# EAGLE design UBEC_V3 (EAGLE 7.6.0)
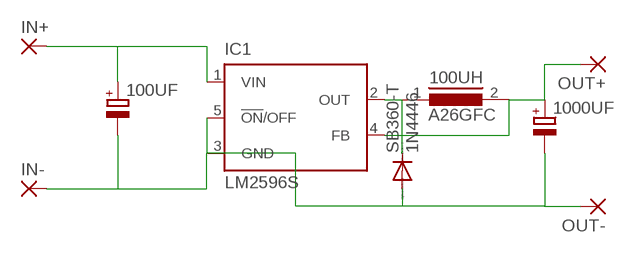
[diagram p0: schematic, sheet 1]

## Parts
100UF  CPOL-EUE3.5-8  [E3,5-8]
100UH  A26GFC  [A26GFC]
1000UF  CPOL-EUE3.5-10  [E3,5-10]
IC1  LM2596S  [TO263-5]
IN+  SMD5  [SMD2,54-5,08]
IN-  SMD5  [SMD2,54-5,08]
OUT+  SMD5  [SMD2,54-5,08]
OUT-  SMD5  [SMD2,54-5,08]
SB360-T  1N4446  [DO35-10]

## Nets
N$1: 100UF.- 1000UF.- IC1.3(GND) IC1.5(!ON!/OFF) IN-.1(P) OUT-.1(P) SB360-T.A
N$2: 100UF.+ IC1.1(VIN) IN+.1(P)
N$3: 100UH.1 IC1.2(OUT) SB360-T.C
N$5: 100UH.2 1000UF.+ IC1.4(FB) OUT+.1(P)

## Library data of the parts
100UF 1000UF = rcl:CPOL-EU: POLARIZED CAPACITOR, European symbol
100UH = inductors:A26GFC: INDUCTOR
IC1 = national-semiconductor:LM2596: SIMPLE SWITCHER® Power Converter 150 kHz 3A Step-Down Voltage Regulator Source: http://www.national.com/ds/LM/LM2596.pdf; MF: NATIONAL SEMICONDUCTOR; MPN: LM2596S-ADJ/NOPB; OC_FARNELL: 9494367; OC_NEWARK: 41K3842
IN+ IN- OUT+ OUT- = wirepad:SMD5: SMD PAD
SB360-T = diode:1N4446: DIODE high speed (Philips)

## Board
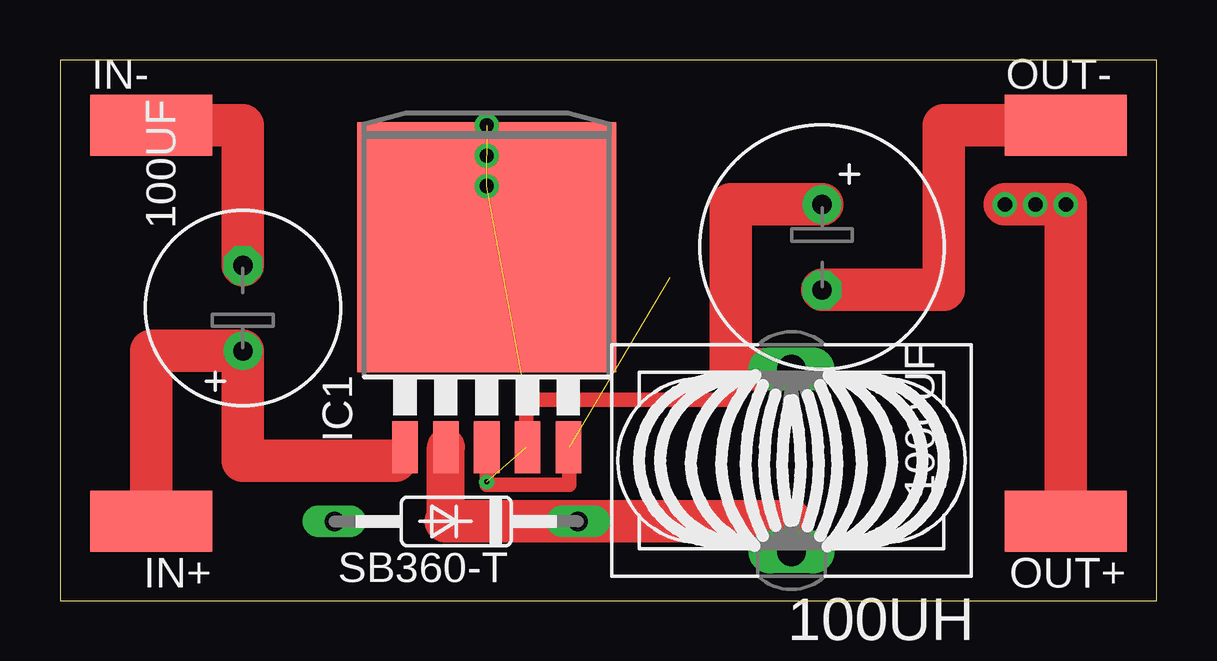
[diagram p1: board, top side]
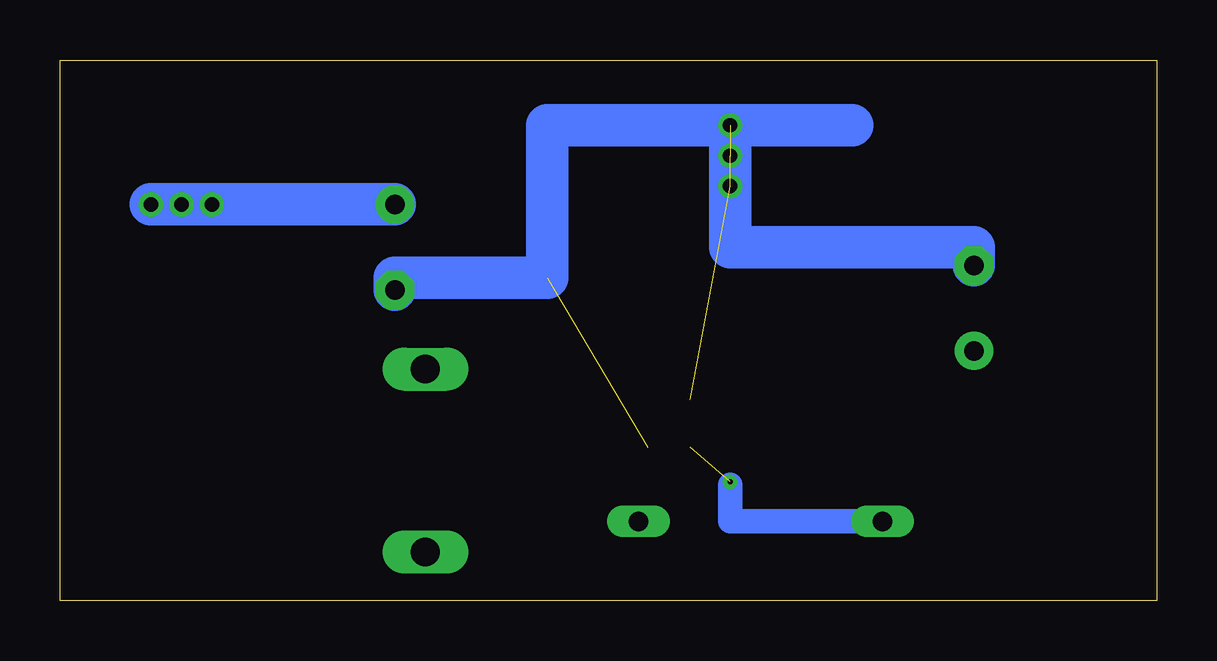
[diagram p2: board, bottom side, seen from below]

Size 45.7 x 22.53 mm. Coordinates in mm from the lower left corner, seen from the top.
Outline: 0,0 45.7,0 45.7,22.53 0,22.53 0,0
Copper layers (1*16): Top 0.035mm / dielectric 1.5mm / Bottom 0.035mm
Design rules "default": minimum track width 10mil, minimum drill 24mil, track to track 8mil, track to pad 8mil, pad to pad 8mil, via to via 8mil, smd to smd 8mil, copper to edge 40mil, drill to drill 8mil, minimum pad ring 10mil, minimum via ring 8mil, stop-mask expansion 4mil, vias tented up to drill 0mil, thermal gap 10mil

### Footprints (pad centres in the part's own frame; a part is rotated, then mirrored left to right if it is on the bottom)
E3,5-8 = drill 0.813 pad 1.6: + -1.778,0 | drill 0.813 pad 1.6 octagon: - 1.778,0
A26GFC = drill 1.194 long: 1 0,3.81; 2 0,-3.81
E3,5-10 = drill 0.813 pad 1.6: + -1.778,0 | drill 0.813 pad 1.6 octagon: - 1.778,0
TO263-5 = smd 1.067 x 2.159: 1 -3.404,-5.791; 2 -1.702,-5.791; 3 0,-5.791; 4 1.702,-5.791; 5 3.404,-5.791 | smd 10.8 x 10.41: 6 0,2.54
SMD2,54-5,08 = smd 2.54 x 5.08: 1 0,0
DO35-10 = drill 0.813 long: A 5.08,0; C -5.08,0

### Placement (x,y rotation side)
100UF  7.62,12.19 90 top
100UH  30.48,5.84 180 top
1000UF  31.75,14.73 270 top
IC1  17.78,12.19 0 top
IN+  3.81,3.3 90 top
IN-  3.81,19.81 270 top
OUT+  41.91,3.3 90 top
OUT-  41.91,19.81 270 top
SB360-T  16.51,3.3 180 top

### Tracks (layer width: path | path; a pad name or v marks a point on that pad's centre or on a via)
N$1  (2 unrouted)
  Top 0.61: IC1.5 21.21,6.4 21.21,4.83 17.78,4.83 IC1.3
  Top 1.778: IN-.1 7.62,19.81 100UF.- | OUT-.1 36.83,19.81 36.83,12.95 1000UF.-
  Bottom 1.016: SB360-T.A 17.78,3.3 17.78,4.83
  Bottom 1.778: 17.78,19.81 17.78,14.73 7.62,14.73 100UF.- | 17.78,19.81 12.7,19.81 | 1000UF.- 31.75,13.46 25.4,13.46 25.4,19.81 17.78,19.81
N$2
  Top 0.406: 13.97,5.84 13.97,6.4 IC1.1
  Top 1.778: 13.97,5.84 7.62,5.84 100UF.+ 3.81,10.41 IN+.1
N$3
  Top 1.575: 16.08,3.3 IC1.2
  Top 1.778: 100UH.1 30.48,3.3 SB360-T.C 16.08,3.3
N$5  (via drill 0.2 pad 0.2, 0.6)  (4 unrouted)
  Top 0.61: IC1.4 19.43,6.4 19.43,8.38 27.94,8.38 27.94,9.65
  Top 1.778: OUT+.1 v41.91,16.51 v40.64,16.51 v39.37,16.51 | 100UH.2 27.94,9.65 27.94,16.51 1000UF.+
  Bottom 1.778: v41.91,16.51 v40.64,16.51 1000UF.+
  other vias: 17.78,17.27 17.78,18.54 17.78,19.81 17.78,4.95